# EAGLE design core (EAGLE 7.1.0)
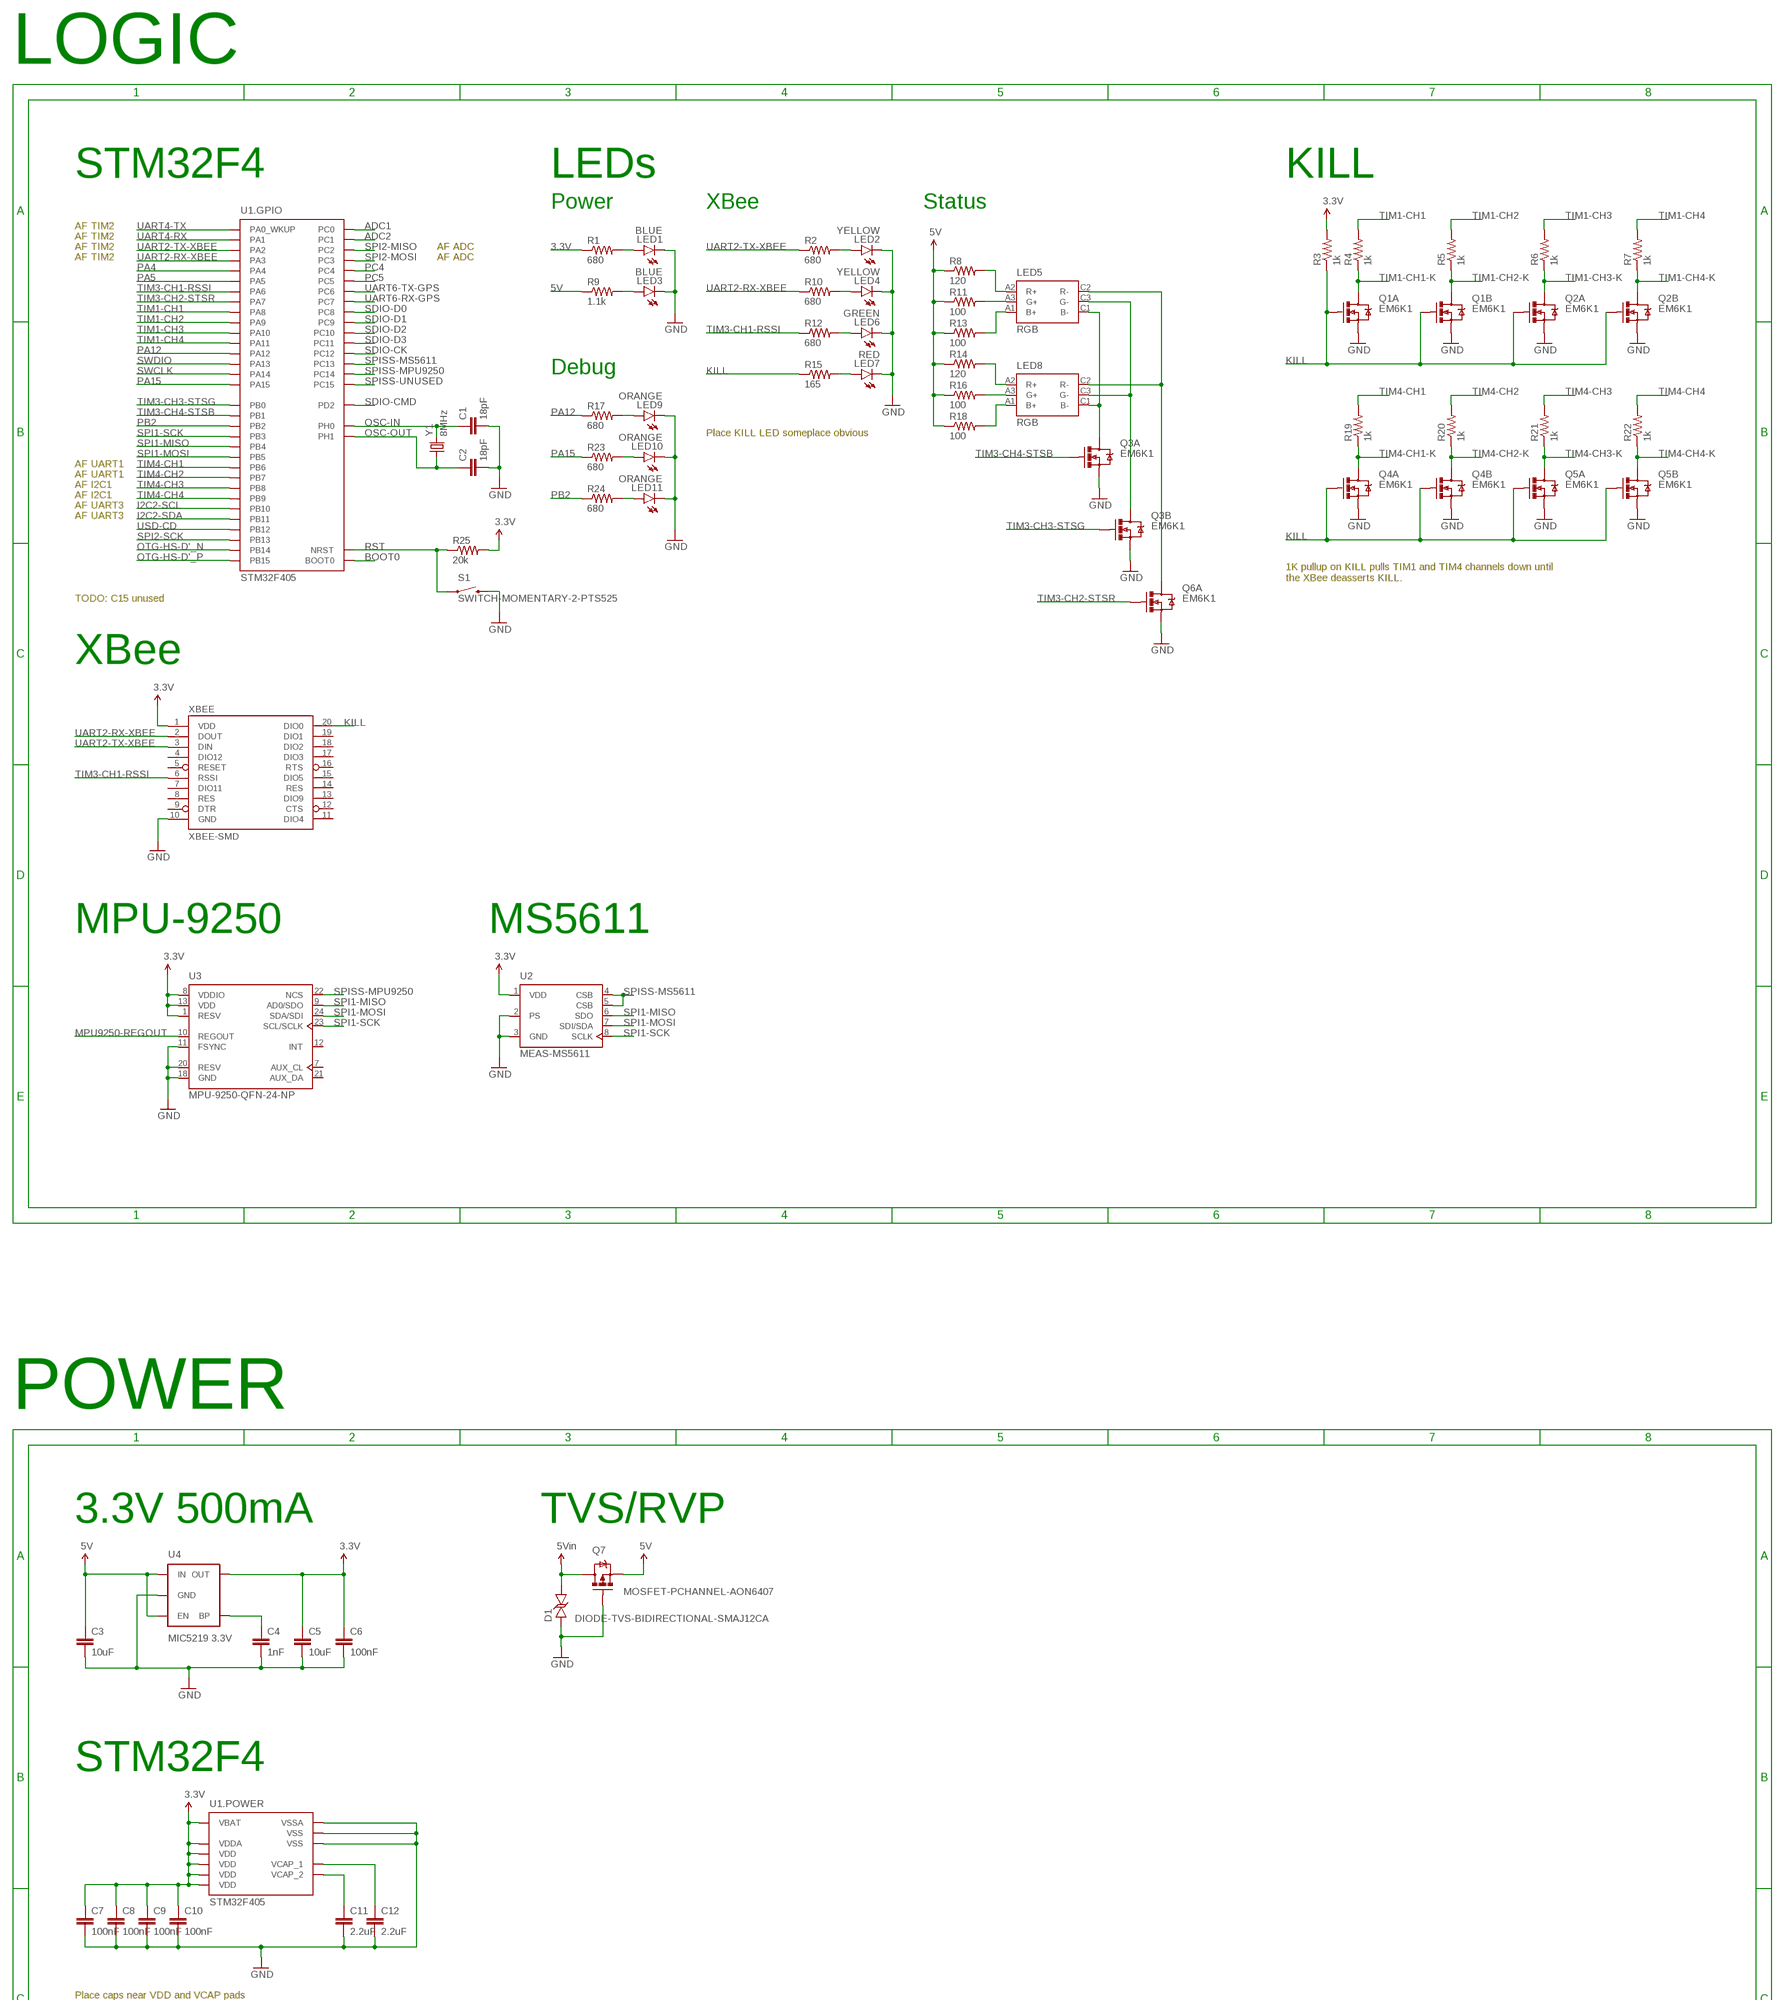
[diagram p0: schematic, sheet 1, part 1 of 2]
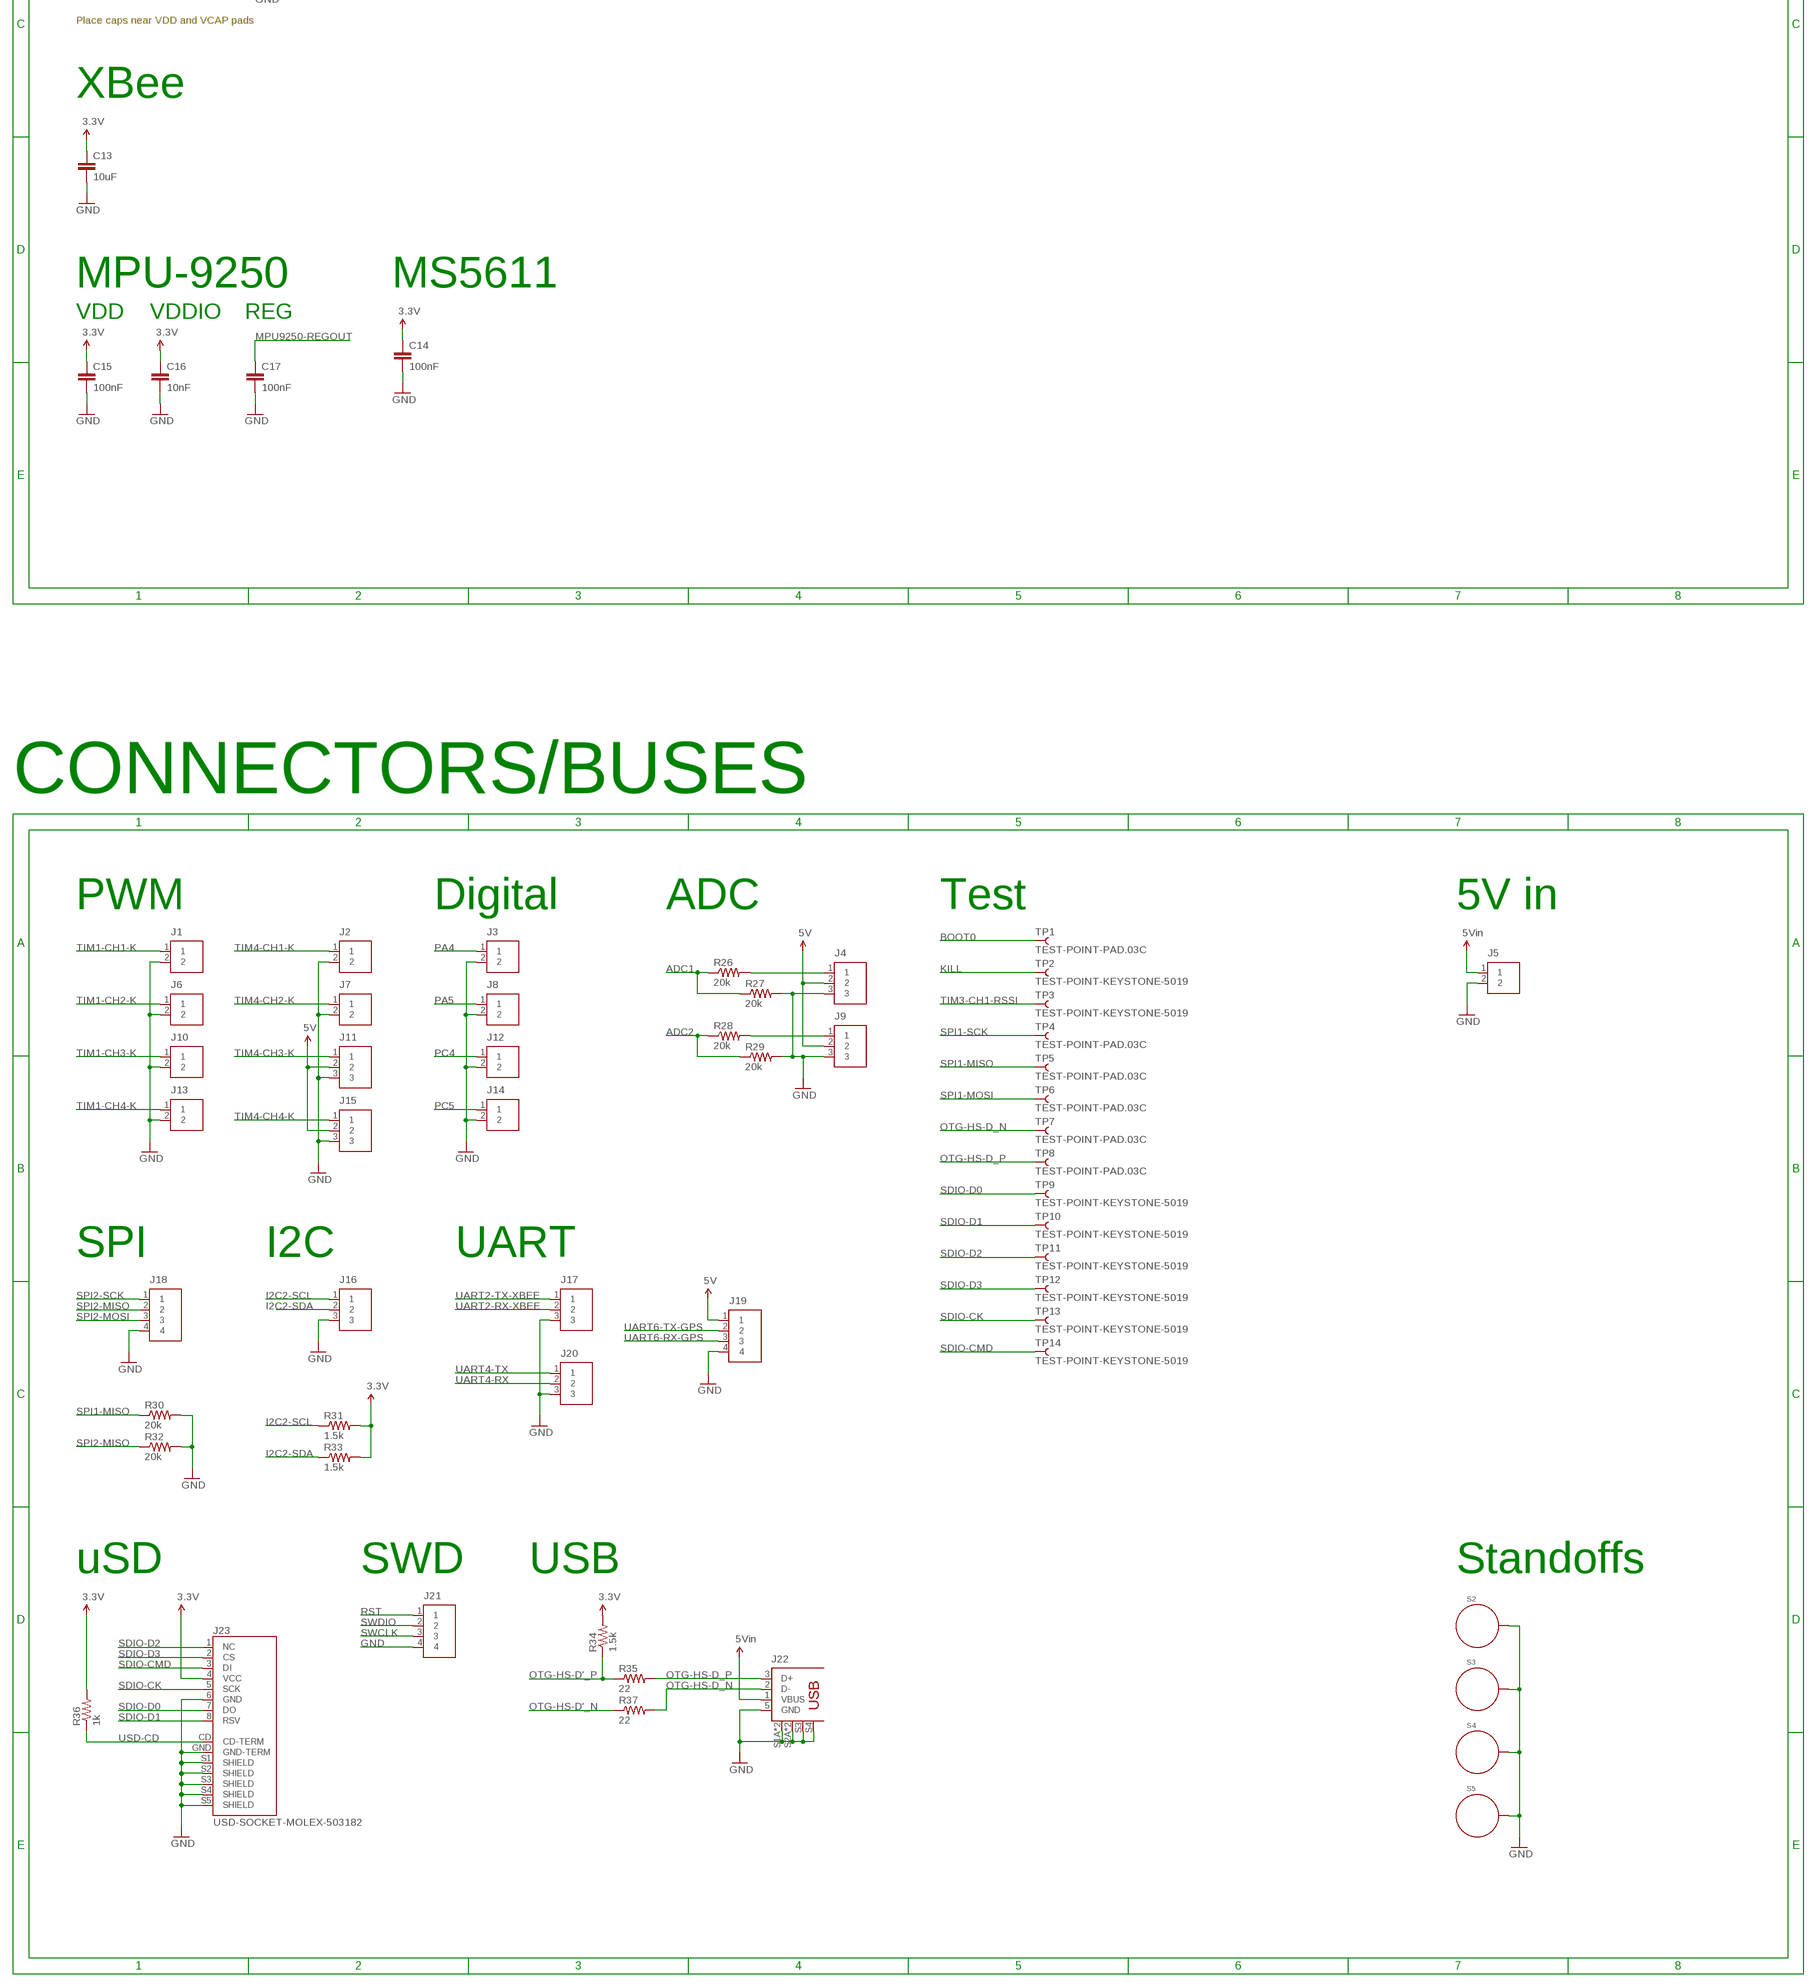
[diagram p1: schematic, sheet 1, part 2 of 2]

## Parts
C1  18pF  CAP-18PF-50V-5%(0603)  [0603]
C2  18pF  CAP-18PF-50V-5%(0603)  [0603]
C3  10uF  CAP-10UF-10V-10%(0805)  [0805]
C4  1nF  CAP-1NF-50V-10%(0603)  [0603]
C5  10uF  CAP-10UF-10V-10%(0805)  [0805]
C6  100nF  CAP-100NF-16V-10%(0603)  [0603]
C7  100nF  CAP-100NF-16V-10%(0603)  [0603]
C8  100nF  CAP-100NF-16V-10%(0603)  [0603]
C9  100nF  CAP-100NF-16V-10%(0603)  [0603]
C10  100nF  CAP-100NF-16V-10%(0603)  [0603]
C11  2.2uF  CAP-2.2UF-10V-10%(0603)  [0603]
C12  2.2uF  CAP-2.2UF-10V-10%(0603)  [0603]
C13  10uF  CAP-10UF-10V-10%(0805)  [0805]
C14  100nF  CAP-100NF-16V-10%(0603)  [0603]
C15  100nF  CAP-100NF-16V-10%(0603)  [0603]
C16  10nF  CAP-10NF-50V-10%(0603)  [0603]
C17  100nF  CAP-100NF-16V-10%(0603)  [0603]
D1  DIODE-TVS-BIDIRECTIONAL-SMAJ12CA  [SMAJ]
J1  M02  [MOLEX-2MM-MICROLATCH-2POS-RA]
J2  M02  [MOLEX-2MM-MICROLATCH-2POS-RA]
J3  M02  [MOLEX-2MM-MICROLATCH-2POS-RA]
J4  M03  [MOLEX-2MM-MICROLATCH-3POS-RA]
J5  M02  [MOLEX-2MM-MICROLATCH-2POS-RA]
J6  M02  [MOLEX-2MM-MICROLATCH-2POS-RA]
J7  M02  [MOLEX-2MM-MICROLATCH-2POS-RA]
J8  M02  [MOLEX-2MM-MICROLATCH-2POS-RA]
J9  M03  [MOLEX-2MM-MICROLATCH-3POS-RA]
J10  M02  [MOLEX-2MM-MICROLATCH-2POS-RA]
J11  M03  [MOLEX-2MM-MICROLATCH-3POS-RA]
J12  M02  [MOLEX-2MM-MICROLATCH-2POS-RA]
J13  M02  [MOLEX-2MM-MICROLATCH-2POS-RA]
J14  M02  [MOLEX-2MM-MICROLATCH-2POS-RA]
J15  M03  [MOLEX-2MM-MICROLATCH-3POS-RA]
J16  M03  [MOLEX-2MM-MICROLATCH-3POS-RA]
J17  M03  [MOLEX-2MM-MICROLATCH-3POS-RA]
J18  M04  [MOLEX-2MM-MICROLATCH-4POS-RA]
J19  M04  [MOLEX-2MM-MICROLATCH-4POS-RA]
J20  M03  [MOLEX-2MM-MICROLATCH-3POS-RA]
J21  M04  [MOLEX-2MM-MICROLATCH-4POS-RA]
J22  USB+SHIELD-MICROB-SMD-MOLEX  [USB-MICROB-SMD-MOLEX]
J23  USD-SOCKET-MOLEX-503182  [USD-SOCKET-PP-MOLEX-503182]
LED1  BLUE  LED-KINGBRIGHT-HELI-BLUE(0603)  [LED-0603]
LED2  YELLOW  LED-KINGBRIGHT-HELI-YELLOW(0603)  [LED-0603]
LED3  BLUE  LED-KINGBRIGHT-HELI-BLUE(0603)  [LED-0603]
LED4  YELLOW  LED-KINGBRIGHT-HELI-YELLOW(0603)  [LED-0603]
LED5  RGB  OSRAM-MULTILED-RGB  [PLCC-6]
LED6  GREEN  LED-KINGBRIGHT-HELI-GREEN(0603)  [LED-0603]
LED7  RED  LED-KINGBRIGHT-HELI-RED(0603)  [LED-0603]
LED8  RGB  OSRAM-MULTILED-RGB  [PLCC-6]
LED9  ORANGE  LED-KINGBRIGHT-HELI-ORANGE(0603)  [LED-0603]
LED10  ORANGE  LED-KINGBRIGHT-HELI-ORANGE(0603)  [LED-0603]
LED11  ORANGE  LED-KINGBRIGHT-HELI-ORANGE(0603)  [LED-0603]
Q1  EM6K1  MOSFET-NCHANNEL-DUAL-EM6K1  [SOT-666]
Q2  EM6K1  MOSFET-NCHANNEL-DUAL-EM6K1  [SOT-666]
Q3  EM6K1  MOSFET-NCHANNEL-DUAL-EM6K1  [SOT-666]
Q4  EM6K1  MOSFET-NCHANNEL-DUAL-EM6K1  [SOT-666]
Q5  EM6K1  MOSFET-NCHANNEL-DUAL-EM6K1  [SOT-666]
Q6  EM6K1  MOSFET-NCHANNEL-DUAL-EM6K1  [SOT-666]
Q7  MOSFET-PCHANNEL-AON6407  [DFN5X6]
R1  680  RES-680OHM-0.1W-5%(0603)  [0603]
R2  680  RES-680OHM-0.1W-5%(0603)  [0603]
R3  1k  RES-1KOHM-0.1W-5%(0603)  [0603]
R4  1k  RES-1KOHM-0.1W-5%(0603)  [0603]
R5  1k  RES-1KOHM-0.1W-5%(0603)  [0603]
R6  1k  RES-1KOHM-0.1W-5%(0603)  [0603]
R7  1k  RES-1KOHM-0.1W-5%(0603)  [0603]
R8  120  RES-120OHM-0.1W-5%(0603)  [0603]
R9  1.1k  RES-1.1KOHM-0.1W-5%(0603)  [0603]
R10  680  RES-680OHM-0.1W-5%(0603)  [0603]
R11  100  RES-100OHM-0.1W-5%(0603)  [0603]
R12  680  RES-680OHM-0.1W-5%(0603)  [0603]
R13  100  RES-100OHM-0.1W-5%(0603)  [0603]
R14  120  RES-120OHM-0.1W-5%(0603)  [0603]
R15  165  RES-165OHM-0.1W-1%(0603)  [0603]
R16  100  RES-100OHM-0.1W-5%(0603)  [0603]
R17  680  RES-680OHM-0.1W-5%(0603)  [0603]
R18  100  RES-100OHM-0.1W-5%(0603)  [0603]
R19  1k  RES-1KOHM-0.1W-5%(0603)  [0603]
R20  1k  RES-1KOHM-0.1W-5%(0603)  [0603]
R21  1k  RES-1KOHM-0.1W-5%(0603)  [0603]
R22  1k  RES-1KOHM-0.1W-5%(0603)  [0603]
R23  680  RES-680OHM-0.1W-5%(0603)  [0603]
R24  680  RES-680OHM-0.1W-5%(0603)  [0603]
R25  20k  RES-20KOHM-0.1W-1%(0603)  [0603]
R26  20k  RES-20KOHM-0.1W-0.1%(0603)  [0603]
R27  20k  RES-20KOHM-0.1W-0.1%(0603)  [0603]
R28  20k  RES-20KOHM-0.1W-0.1%(0603)  [0603]
R29  20k  RES-20KOHM-0.1W-0.1%(0603)  [0603]
R30  20k  RES-20KOHM-0.1W-1%(0603)  [0603]
R31  1.5k  RES-1.5KOHM-0.1W-5%(0603)  [0603]
R32  20k  RES-20KOHM-0.1W-1%(0603)  [0603]
R33  1.5k  RES-1.5KOHM-0.1W-5%(0603)  [0603]
R34  1.5k  RES-1.5KOHM-0.1W-5%(0603)  [0603]
R35  22  RES-22OHM-0.1W-5%(0603)  [0603]
R36  1k  RES-1KOHM-0.1W-5%(0603)  [0603]
R37  22  RES-22OHM-0.1W-5%(0603)  [0603]
S1  SWITCH-MOMENTARY-2-PTS525  [TACTILE-SWITCH-SMD]
S2  STANDOFF_ELECTRICAL-#4  [STANDOFF-ELECTRICAL-#4]
S3  STANDOFF_ELECTRICAL-#4  [STANDOFF-ELECTRICAL-#4]
S4  STANDOFF_ELECTRICAL-#4  [STANDOFF-ELECTRICAL-#4]
S5  STANDOFF_ELECTRICAL-#4  [STANDOFF-ELECTRICAL-#4]
TP1  TEST-POINT-PAD.03C  [PAD-.03C]
TP2  TEST-POINT-KEYSTONE-5019  [PAD.15X.08]
TP3  TEST-POINT-KEYSTONE-5019  [PAD.15X.08]
TP4  TEST-POINT-PAD.03C  [PAD-.03C]
TP5  TEST-POINT-PAD.03C  [PAD-.03C]
TP6  TEST-POINT-PAD.03C  [PAD-.03C]
TP7  TEST-POINT-PAD.03C  [PAD-.03C]
TP8  TEST-POINT-PAD.03C  [PAD-.03C]
TP9  TEST-POINT-KEYSTONE-5019  [PAD.15X.08]
TP10  TEST-POINT-KEYSTONE-5019  [PAD.15X.08]
TP11  TEST-POINT-KEYSTONE-5019  [PAD.15X.08]
TP12  TEST-POINT-KEYSTONE-5019  [PAD.15X.08]
TP13  TEST-POINT-KEYSTONE-5019  [PAD.15X.08]
TP14  TEST-POINT-KEYSTONE-5019  [PAD.15X.08]
U1  STM32F405  [LQFP-64-STM32F405]
U2  MEAS-MS5611  [MEAS-MS5611]
U3  MPU-9250-QFN-24-NP  [QFN-24-NP]
U4  MIC5219 3.3V  V-REG-MIC5219-3.3V  [SOT23-5]
XBEE  XBEE-SMD  [XBEE-SMD]
Y1  8MHz  CRYSTAL-8MHZ-CX532  [CX532]

## Nets
3.3V: C5.2 C6.2 C7.2 C8.2 C9.2 C10.2 C13.2 C14.2 C15.2 C16.2 J23.4(VCC) R1.1 R3.2 R25.2 R31.2 R33.2 R34.2 R36.2 U1.1(.POWER:VBAT) U1.13(.POWER:VDDA) U1.19(.POWER:VDD) U1.32(.POWER:VDD) U1.48(.POWER:VDD) U1.64(.POWER:VDD) U2.1(VDD) U3.1(RESV) U3.8(VDDIO) U3.13(VDD) U4.5(OUT) XBEE.1(VDD)
5V: C3.2 J4.2 J9.2 J11.2 J15.2 J19.1 Q7.1(S) Q7.2(S) Q7.3(S) R8.1 R9.1 R11.1 R13.1 R14.1 R16.1 R18.1 U4.1(IN) U4.3(EN)
ADC1: R26.1 R27.1 U1.8(.GPIO:PC0)
ADC1-IN: J4.1 R26.2
ADC2: R28.1 R29.1 U1.9(.GPIO:PC1)
ADC2-IN: J9.1 R28.2
BOOT0: TP1.1 U1.60(.GPIO:BOOT0)
F4-VCAP-1: C11.2 U1.47(.POWER:VCAP_2)
F4-VCAP-2: C12.2 U1.31(.POWER:VCAP_1)
GND: C1.1 C2.1 C3.1 C4.1 C5.1 C6.1 C7.1 C8.1 C9.1 C10.1 C11.1 C12.1 C13.1 C14.1 C15.1 C16.1 C17.1 D1.A J1.2 J2.2 J3.2 J4.3 J5.2 J6.2 J7.2 J8.2 J9.3 J10.2 J11.3 J12.2 J13.2 J14.2 J15.3 J16.3 J17.3 J18.4 J19.4 J20.3 J21.4 J22.5(GND) J22.S1A(S1) J22.S1B(S1) J22.S2A(S2) J22.S2B(S2) J22.S3 J22.S4 J23.6(GND) J23.GND(GND-TERM) J23.S1(SHIELD) J23.S2(SHIELD) J23.S3(SHIELD) J23.S4(SHIELD) J23.S5(SHIELD) LED1.C LED2.C LED3.C LED4.C LED6.C LED7.C LED9.C LED10.C LED11.C Q1.1(A:S) Q1.4(B:S) Q2.1(A:S) Q2.4(B:S) Q3.1(A:S) Q3.4(B:S) Q4.1(A:S) Q4.4(B:S) Q5.1(A:S) Q5.4(B:S) Q6.1(A:S) Q7.4(G) R27.2 R29.2 R30.2 R32.2 S1.3 S1.4 S2.P1 S3.P1 S4.P1 S5.P1 U1.12(.POWER:VSSA) U1.18(.POWER:VSS) U1.63(.POWER:VSS) U2.2(PS) U2.3(GND) U3.11(FSYNC) U3.18(GND) U3.20(RESV) U4.2(GND) XBEE.10(GND)
I2C2-SCL: J16.1 R31.1 U1.29(.GPIO:PB10)
I2C2-SDA: J16.2 R33.1 U1.30(.GPIO:PB11)
KILL: Q1.2(A:G) Q1.5(B:G) Q2.2(A:G) Q2.5(B:G) Q4.2(A:G) Q4.5(B:G) Q5.2(A:G) Q5.5(B:G) R3.1 R15.1 TP2.1 XBEE.20(DIO0)
MIC-BP: C4.2 U4.4(BP)
MPU9250-REGOUT: C17.2 U3.10(REGOUT)
N$2: LED9.A R17.2
N$3: LED10.A R23.2
N$4: LED11.A R24.2
N$34: LED6.A R12.2
N$35: LED7.A R15.2
N$36: LED2.A R2.2
N$37: LED4.A R10.2
N$38: LED1.A R1.2
N$39: LED3.A R9.2
OSC-IN: C1.2 U1.5(.GPIO:PH0) Y1.2
OSC-OUT: C2.2 U1.6(.GPIO:PH1) Y1.1
OTG-HS-D'_N [USB]: R37.1 U1.35(.GPIO:PB14)
OTG-HS-D'_P [USB]: R34.1 R35.1 U1.36(.GPIO:PB15)
OTG-HS-D_N [USB]: J22.2(D-) R37.2 TP7.1
OTG-HS-D_P [USB]: J22.3(D+) R35.2 TP8.1
PA4: J3.1 U1.20(.GPIO:PA4)
PA5: J8.1 U1.21(.GPIO:PA5)
PA12: R17.1 U1.45(.GPIO:PA12)
PA15: R23.1 U1.50(.GPIO:PA15)
PB2: R24.1 U1.28(.GPIO:PB2)
PC4: J12.1 U1.24(.GPIO:PC4)
PC5: J14.1 U1.25(.GPIO:PC5)
RST: J21.1 R25.1 S1.1 S1.2 U1.7(.GPIO:NRST)
SDIO-CK: J23.5(SCK) TP13.1 U1.53(.GPIO:PC12)
SDIO-CMD: J23.3(DI) TP14.1 U1.54(.GPIO:PD2)
SDIO-D0: J23.7(DO) TP9.1 U1.39(.GPIO:PC8)
SDIO-D1: J23.8(RSV) TP10.1 U1.40(.GPIO:PC9)
SDIO-D2: J23.1(NC) TP11.1 U1.51(.GPIO:PC10)
SDIO-D3: J23.2(CS) TP12.1 U1.52(.GPIO:PC11)
SPI1-MISO: R30.1 TP5.1 U1.56(.GPIO:PB4) U2.6(SDO) U3.9(AD0/SDO)
SPI1-MOSI: TP6.1 U1.57(.GPIO:PB5) U2.7(SDI/SDA) U3.24(SDA/SDI)
SPI1-SCK: TP4.1 U1.55(.GPIO:PB3) U2.8(SCLK) U3.23(SCL/SCLK)
SPI2-MISO: J18.2 R32.1 U1.10(.GPIO:PC2)
SPI2-MOSI: J18.3 U1.11(.GPIO:PC3)
SPI2-SCK: J18.1 U1.34(.GPIO:PB13)
SPISS-MPU9250: U1.3(.GPIO:PC14) U3.22(NCS)
SPISS-MS5611: U1.2(.GPIO:PC13) U2.4(CSB) U2.5(CSB)
SPISS-UNUSED: U1.4(.GPIO:PC15)
STSB1+: LED5.A1(B+) R13.2
STSB2+: LED8.A1(B+) R18.2
STSB-: LED5.C1(B-) LED8.C1(B-) Q3.6(A:D)
STSG1+: LED5.A3(G+) R11.2
STSG2+: LED8.A3(G+) R16.2
STSG-: LED5.C3(G-) LED8.C3(G-) Q3.3(B:D)
STSR1+: LED5.A2(R+) R8.2
STSR2+: LED8.A2(R+) R14.2
STSR-: LED5.C2(R-) LED8.C2(R-) Q6.6(A:D)
SWCLK: J21.3 U1.49(.GPIO:PA14)
SWDIO: J21.2 U1.46(.GPIO:PA13)
TIM1-CH1: R4.2 U1.41(.GPIO:PA8)
TIM1-CH1-K: J1.1 Q1.6(A:D) R4.1
TIM1-CH2: R5.2 U1.42(.GPIO:PA9)
TIM1-CH2-K: J6.1 Q1.3(B:D) R5.1
TIM1-CH3: R6.2 U1.43(.GPIO:PA10)
TIM1-CH3-K: J10.1 Q2.6(A:D) R6.1
TIM1-CH4: R7.2 U1.44(.GPIO:PA11)
TIM1-CH4-K: J13.1 Q2.3(B:D) R7.1
TIM3-CH1-RSSI: R12.1 TP3.1 U1.22(.GPIO:PA6) XBEE.6(RSSI)
TIM3-CH2-STSR: Q6.2(A:G) U1.23(.GPIO:PA7)
TIM3-CH3-STSG: Q3.5(B:G) U1.26(.GPIO:PB0)
TIM3-CH4-STSB: Q3.2(A:G) U1.27(.GPIO:PB1)
TIM4-CH1: R19.2 U1.58(.GPIO:PB6)
TIM4-CH1-K: J2.1 Q4.6(A:D) R19.1
TIM4-CH2: R20.2 U1.59(.GPIO:PB7)
TIM4-CH2-K: J7.1 Q4.3(B:D) R20.1
TIM4-CH3: R21.2 U1.61(.GPIO:PB8)
TIM4-CH3-K: J11.1 Q5.6(A:D) R21.1
TIM4-CH4: R22.2 U1.62(.GPIO:PB9)
TIM4-CH4-K: J15.1 Q5.3(B:D) R22.1
UART2-RX-XBEE: J17.2 R10.1 U1.17(.GPIO:PA3) XBEE.2(DOUT)
UART2-TX-XBEE: J17.1 R2.1 U1.16(.GPIO:PA2) XBEE.3(DIN)
UART4-RX: J20.2 U1.15(.GPIO:PA1)
UART4-TX: J20.1 U1.14(.GPIO:PA0_WKUP)
UART6-RX-GPS: J19.3 U1.38(.GPIO:PC7)
UART6-TX-GPS: J19.2 U1.37(.GPIO:PC6)
USD-CD: J23.CD(CD-TERM) R36.1 U1.33(.GPIO:PB12)
VIN: D1.C J5.1 J22.1(VBUS) Q7.5(D) Q7.6(D) Q7.7(D) Q7.8(D) Q7.9(D) Q7.10(D) ; supply symbol labelled 5Vin
Unconnected: Q6.3(B:D) Q6.4(B:S) Q6.5(B:G) U3.7(AUX_CL) U3.12(INT) U3.21(AUX_DA) XBEE.4(DIO12) XBEE.5(RESET) XBEE.7(DIO11) XBEE.8(RES) XBEE.9(DTR) XBEE.11(DIO4) XBEE.12(CTS) XBEE.13(DIO9) XBEE.14(RES) XBEE.15(DIO5) XBEE.16(RTS) XBEE.17(DIO3) XBEE.18(DIO2) XBEE.19(DIO1)

## Notes on the sheet
- LOGIC
- STM32F4 | LEDs | KILL
- Power | XBee | Status
- AF TIM2
- AF TIM2
- AF TIM2 | AF ADC
- AF TIM2 | AF ADC
- Debug
- Place KILL LED someplace obvious
- AF UART1
- AF UART1
- AF I2C1
- AF I2C1
- AF UART3
- AF UART3
- 1K pullup on KILL pulls TIM1 and TIM4 channels down until 
  the XBee deasserts KILL.
- TODO: C15 unused
- XBee
- MPU-9250 | MS5611
- POWER
- 3.3V 500mA | TVS/RVP
- STM32F4
- Place caps near VDD and VCAP pads
- XBee
- MPU-9250 | MS5611
- VDD | VDDIO | REG
- CONNECTORS/BUSES
- PWM | Digital | ADC | Test | 5V in
- SPI | I2C | UART
- uSD | SWD | USB | Standoffs

## Library data of the parts
C1 C2 = OSURC_Passives:CAP; DIGIKEY_PN: 490-1409-1-ND
C3 C5 C13 = OSURC_Passives:CAP; DIGIKEY_PN: 490-1709-1-ND
C4 = OSURC_Passives:CAP; DIGIKEY_PN: 490-1494-1-ND
C6-C10 C14 C15 C17 = OSURC_Passives:CAP; DIGIKEY_PN: 490-1532-1-ND
C11 C12 = OSURC_Passives:CAP; DIGIKEY_PN: 490-1545-1-ND
C16 = OSURC_Passives:CAP; DIGIKEY_PN: 490-1512-1-ND
D1 = OSURC_DiscreteSemi:DIODE-TVS-BIDIRECTIONAL: Generic bidirectional TVS diode.; DIGIKEY_PN: SMAJ12CABCT-ND
J1-J3 J5-J8 J10 J12-J14 = OSURC_Connectors:M02; DIGIKEY_PN: WM18999-ND
J4 J9 J11 J15-J17 J20 = OSURC_Connectors:M03; DIGIKEY_PN: WM19000-ND
J18 J19 J21 = OSURC_Connectors:M04; DIGIKEY_PN: WM19001-ND
J22 = OSURC_Connectors:USB+SHIELD: USB+Shield USB connector with shield pins connectable; DIGIKEY_PN: WM17141CT-ND
J23 = OSURC_Connectors:USD-SOCKET: Molex microSD socket Push-push type uSD socket. tDoc lines correctly indicate media card edge positions when inserting (unlocked, locked, depressed).; DIGIKEY_PN: WM9750CT-ND
LED1 LED3 = OSURC_LED:LED-KINGBRIGHT-HELI: Kingbright HELI series LEDs. 0603 package, hella bright.; DIGIKEY_PN: 754-1789-1-ND
LED2 LED4 = OSURC_LED:LED-KINGBRIGHT-HELI: Kingbright HELI series LEDs. 0603 package, hella bright.; DIGIKEY_PN: 754-1788-1-ND
LED5 LED8 = OSURC_LED:OSRAM-MULTILED-RGB: Compact, blindingly bright RGB LED.; DIGIKEY_PN: 475-2899-1-ND
LED6 = OSURC_LED:LED-KINGBRIGHT-HELI: Kingbright HELI series LEDs. 0603 package, hella bright.; DIGIKEY_PN: 754-1790-1-ND
LED7 = OSURC_LED:LED-KINGBRIGHT-HELI: Kingbright HELI series LEDs. 0603 package, hella bright.; DIGIKEY_PN: 754-1786-1-ND
LED9-LED11 = OSURC_LED:LED-KINGBRIGHT-HELI: Kingbright HELI series LEDs. 0603 package, hella bright.; DIGIKEY_PN: 754-1787-1-ND
Q1-Q6 = OSURC_DiscreteSemi:MOSFET-NCHANNEL-DUAL: Dual N-Channel 30-V (D-S) MOSFET FDMA1024NZ TRANS-09516 http://www.vishay.com/docs/71053/71053.pdf; DIGIKEY_PN: EM6K1T2RCT-ND
Q7 = OSURC_DiscreteSemi:MOSFET-PCHANNEL: Generic PMOSFET IRLML2244 - TRANS-11153 (SOT-23 -20V -4.3A) (1.Gate 2.Source 3.Drain) FQP27P06 - COM-10349 <http://www.sparkfun.com/products/10349> (TO-220 -60V -27A) (1.Gate 2.Source 3.Drain); DIGIKEY_PN: 785-1421-1-ND
R1 R2 R10 R12 R17 R23 R24 = OSURC_Passives:RES; DIGIKEY_PN: P680GCT-ND
R3-R7 R19-R22 R36 = OSURC_Passives:RES; DIGIKEY_PN: P1.0KGCT-ND
R8 R14 = OSURC_Passives:RES; DIGIKEY_PN: P120GCT-ND
R9 = OSURC_Passives:RES; DIGIKEY_PN: P1.1KGCT-ND
R11 R13 R16 R18 = OSURC_Passives:RES; DIGIKEY_PN: P100GCT-ND
R15 = OSURC_Passives:RES; DIGIKEY_PN: P165HCT-ND
R25 R30 R32 = OSURC_Passives:RES; DIGIKEY_PN: P20.0KHCT-ND
R26-R29 = OSURC_Passives:RES; DIGIKEY_PN: P20KDBCT-ND
R31 R33 R34 = OSURC_Passives:RES; DIGIKEY_PN: P1.5KGCT-ND
R35 R37 = OSURC_Passives:RES; DIGIKEY_PN: P22GCT-ND
S1 = OSURC_Electromechanical:SWITCH-MOMENTARY-2: Various NO switches- pushbuttons, reed, etc; DIGIKEY_PN: CKN9104CT-ND
S2-S5 = OSURC_Electromechanical:STANDOFF_ELECTRICAL: A standoff intended to be an electrically connected point. Pad size and stop size allow for a #4 Phillips pan screw head to make a solid connection to the board.
TP1 TP4-TP8 = OSURC_Passives:TEST-POINT: Test points
TP2 TP3 TP9-TP14 = OSURC_Passives:TEST-POINT: Test points; DIGIKEY_PN: 5019KCT-ND
U1 = OSURC_DigitalIC:STM32F405: Fast little Cortex-M4 ARM used by everyone jumping on the custom flight control bandwagon.; DIGIKEY_PN: 497-11767-ND
U2 = OSURC_Sensors:MEAS-MS5611: Fast, accurate barometer.; CDI_PN: MS561101BA03-50
U3 = OSURC_Sensors:MPU-9250: 9DOF (3mag, 3accel, 3gyro). SPI/I2C interface.; CDI_PN: MPU-9250
U4 = OSURC_PowerIC:V-REG-MIC5219: V_REG MIC5219 Standard 3.3V and 5V 500mA LDO voltage regulator in SOT-23 layout. Micrel part MIC5219. BP (by-pass) pin is used to lower output noise with 470pF cap, may be left open.; DIGIKEY_PN: 576-1281-1-ND
XBEE = OSURC_RF:XBEE: Xbee module footprints; DIGIKEY_PN: S5902-10-ND
Y1 = OSURC_FreqCtrl:CRYSTAL: Various standard crystals. Proven footprints.; DIGIKEY_PN: 370-1169-1-ND

## Net classes
1 USB: width 0.61 mm

## Board
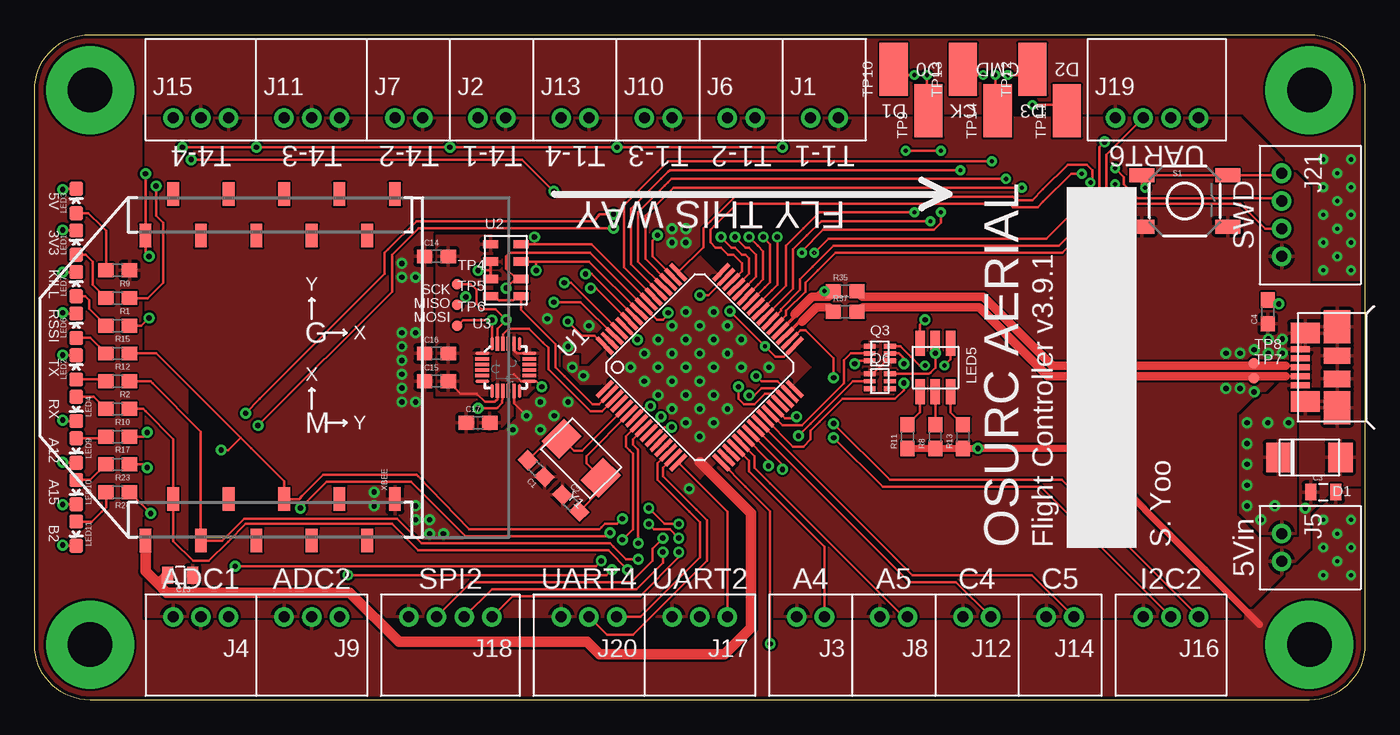
[diagram p2: board, top side]
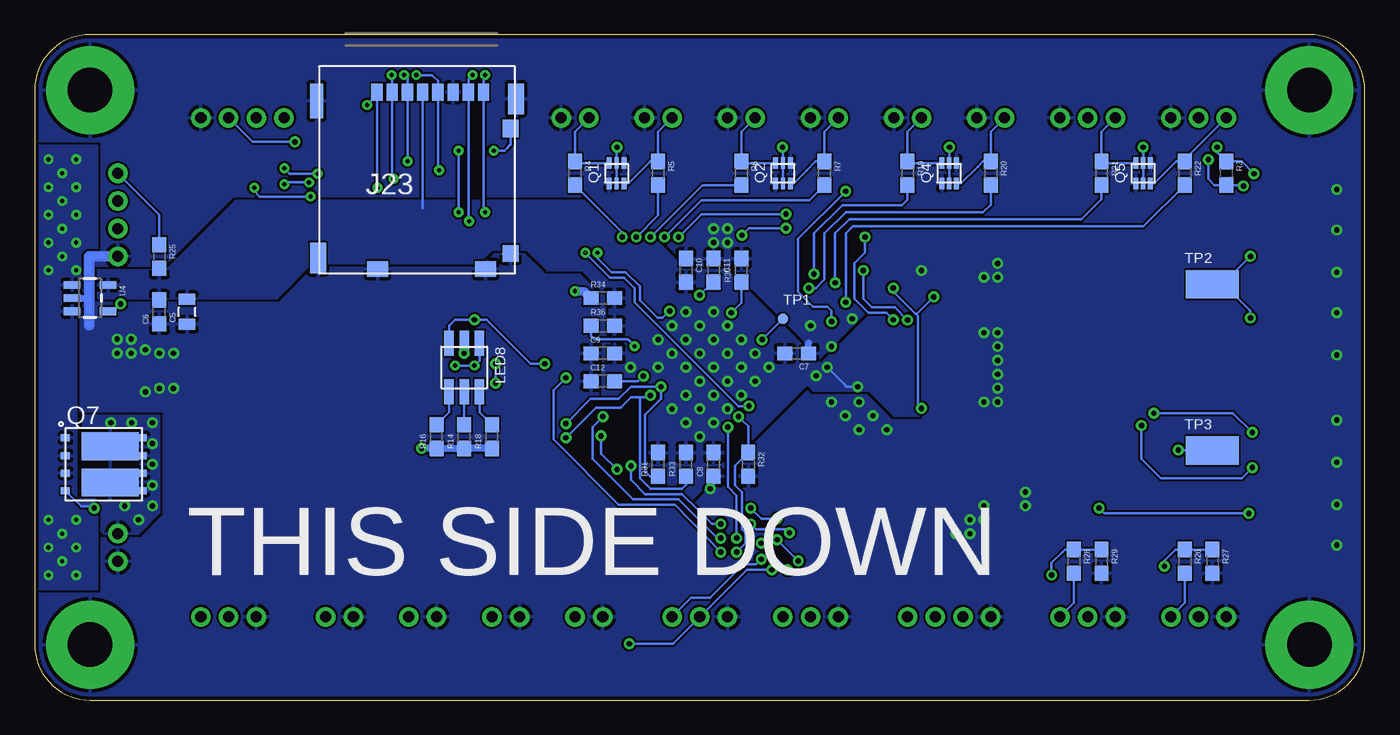
[diagram p3: board, bottom side, seen from below]

Size 96 x 48 mm. Coordinates in mm from the lower left corner, seen from the top.
Outline: 4,48 92,48 arc-90 96,44 96,4 arc-90 92,0 4,0 arc-90 0,4 0,44 arc-90 4,48
Copper layers (1*16): Top 0.035mm / dielectric 1.5mm / Bottom 0.035mm
Design rules "core": minimum track width 6mil, minimum drill 12mil, track to track 6mil, track to pad 6mil, pad to pad 6mil, via to via 6mil, smd to smd 0mil, copper to edge 10mil, drill to drill 10mil, minimum pad ring 12mil, minimum via ring 8mil, stop-mask expansion 2mil, vias tented up to drill 25mil, thermal gap 10mil

### Footprints (pad centres in the part's own frame; a part is rotated, then mirrored left to right if it is on the bottom)
0603 = smd 1.1 x 1: 1 -0.85,0; 2 0.85,0
0805 = smd 0.8 x 1.2: 1 -0.9,0; 2 0.9,0
SMAJ = smd 1.778 x 2.108: A -2.235,0; C 2.235,0
MOLEX-2MM-MICROLATCH-2POS-RA = drill 0.8: 1 0,0; 2 2,0
MOLEX-2MM-MICROLATCH-3POS-RA = drill 0.8: 1 0,0; 2 2,0; 3 4,0
MOLEX-2MM-MICROLATCH-4POS-RA = drill 0.8: 1 0,0; 2 2,0; 3 4,0; 4 6,0
USB-MICROB-SMD-MOLEX = smd 0.45 x 1.38: 1 -1.3,2.66; 2 -0.65,2.66; 3 0,2.66; 4 0.65,2.66; 5 1.3,2.66 | smd 2.375 x 1.9: S1A -2.913,0; S2A 2.913,0 | smd 1.175 x 1.9: S1B -0.838,0; S2B 0.838,0 | smd 1.475 x 2.1: S3 -2.462,2.3; S4 2.462,2.3
USD-SOCKET-PP-MOLEX-503182 = smd 0.8 x 1.24: 1 4.82,-0.62; 2 5.92,-0.62; 3 7.02,-0.62; 4 8.12,-0.62; 5 9.22,-0.62; 6 10.32,-0.62; 7 11.42,-0.62; 8 12.52,-0.62 | smd 1.16 x 1.25: CD 14.46,-3.25 | smd 1.16 x 1.2: GND 14.46,-12.25 | smd 1.15 x 2.2: S1 14.865,-1.1; S3 0.575,-12.58 | smd 0.95 x 2.5: S2 0.475,-1.25 | smd 1.5 x 1.15: S4 4.88,-13.375; S5 12.66,-13.375
LED-0603 = smd 1 x 1: A 0,-0.877; C 0,0.877
PLCC-6 = smd 1.8 x 0.7: A1 1.75,1.1; A2 1.75,0; A3 1.75,-1.1; C1 -1.75,1.1; C2 -1.75,0; C3 -1.75,-1.1
SOT-666 = smd 0.84 x 0.36: 1 -0.73,0.53; 3 -0.73,-0.53; 4 0.73,-0.53; 6 0.73,0.53 | smd 0.84 x 0.3: 2 -0.73,0; 5 0.73,0
DFN5X6 = smd 0.65 x 0.5: 1 -2.775,1.905; 2 -2.775,0.635; 3 -2.775,-0.635; 4 -2.775,-1.905; 5 2.775,-1.905; 6 2.775,-0.635; 7 2.775,0.635; 8 2.775,1.905 | smd 4.12 x 2: 9 0.46,1.3; 10 0.46,-1.3
TACTILE-SWITCH-SMD = smd 1.8 x 1: 1 -3.1,1.85; 2 3.1,1.85; 3 -3.1,-1.85; 4 3.1,-1.85
STANDOFF-ELECTRICAL-#4 = drill 3.2 pad 6.35: P1 0,0
PAD-.03C = smd 0.762 x 0.762: 1 0,0
PAD.15X.08 = smd 3.81 x 2.032: 1 0,0
LQFP-64-STM32F405 = smd 1.6 x 0.3: 1 -5.95,3.75; 2 -5.95,3.25; 3 -5.95,2.75; 4 -5.95,2.25; 5 -5.95,1.75; 6 -5.95,1.25; 7 -5.95,0.75; 8 -5.95,0.25; 9 -5.95,-0.25; 10 -5.95,-0.75; 11 -5.95,-1.25; 12 -5.95,-1.75; 13 -5.95,-2.25; 14 -5.95,-2.75; 15 -5.95,-3.25; 16 -5.95,-3.75; 33 5.95,-3.75; 34 5.95,-3.25; 35 5.95,-2.75; 36 5.95,-2.25; 37 5.95,-1.75; 38 5.95,-1.25; 39 5.95,-0.75; 40 5.95,-0.25; 41 5.95,0.25; 42 5.95,0.75; 43 5.95,1.25; 44 5.95,1.75; 45 5.95,2.25; 46 5.95,2.75; 47 5.95,3.25; 48 5.95,3.75 | smd 0.3 x 1.6: 17 -3.75,-5.95; 18 -3.25,-5.95; 19 -2.75,-5.95; 20 -2.25,-5.95; 21 -1.75,-5.95; 22 -1.25,-5.95; 23 -0.75,-5.95; 24 -0.25,-5.95; 25 0.25,-5.95; 26 0.75,-5.95; 27 1.25,-5.95; 28 1.75,-5.95; 29 2.25,-5.95; 30 2.75,-5.95; 31 3.25,-5.95; 32 3.75,-5.95; 49 3.75,5.95; 50 3.25,5.95; 51 2.75,5.95; 52 2.25,5.95; 53 1.75,5.95; 54 1.25,5.95; 55 0.75,5.95; 56 0.25,5.95; 57 -0.25,5.95; 58 -0.75,5.95; 59 -1.25,5.95; 60 -1.75,5.95; 61 -2.25,5.95; 62 -2.75,5.95; 63 -3.25,5.95; 64 -3.75,5.95
MEAS-MS5611 = smd 1.1 x 0.6: 1 -1.1,1.875; 2 -1.1,0.625; 3 -1.1,-0.625; 4 -1.1,-1.875; 5 1.1,-1.875; 6 1.1,-0.625; 7 1.1,0.625; 8 1.1,1.875
QFN-24-NP-3X3MM = smd 1 x 0.25: 1 -1.7,1; 2 -1.7,0.6; 3 -1.7,0.2; 4 -1.7,-0.2; 5 -1.7,-0.6; 6 -1.7,-1; 13 1.7,-1; 14 1.7,-0.6; 15 1.7,-0.2; 16 1.7,0.2; 17 1.7,0.6; 18 1.7,1 | smd 0.25 x 1: 7 -1,-1.7; 8 -0.6,-1.7; 9 -0.2,-1.7; 10 0.2,-1.7; 11 0.6,-1.7; 12 1,-1.7; 19 1,1.7; 20 0.6,1.7; 21 0.2,1.7; 22 -0.2,1.7; 23 -0.6,1.7; 24 -1,1.7
SOT23-5 = smd 0.55 x 1.2: 1 -0.95,-1.3; 2 0,-1.3; 3 0.95,-1.3; 4 0.95,1.3; 5 -0.95,1.3
XBEE-SMD = smd 1.7 x 0.85: 1 -12.5,20; 2 -9.5,18; 3 -12.5,16; 4 -9.5,14; 5 -12.5,12; 6 -9.5,10; 7 -12.5,8; 8 -9.5,6; 9 -12.5,4; 10 -9.5,2; 11 12.5,2; 12 9.5,4; 13 12.5,6; 14 9.5,8; 15 12.5,10; 16 9.5,12; 17 12.5,14; 18 9.5,16; 19 12.5,18; 20 9.5,20
CX532 = smd 1.8 x 2.3: 1 -2,0; 2 2,0

### Placement (x,y rotation side)
C1  36.19,16.69 135 top
C2  38.69,14.19 315 top
C3  93,15 0 top
C4  89,28 90 top
C5  85,28 90 bottom
C6  87,28 90 bottom
C7  41,25 180 bottom
C8  47,17 90 bottom
C9  55,25 0 bottom
C10  49,31 270 bottom
C11  47,31 270 bottom
C12  55,23 0 bottom
C13  10.5,9 180 top
C14  29,32 0 top
C15  29,23 0 top
C16  29,25 0 top
C17  32,20 0 top
D1  92,17.5 180 top
J1  56,42 0 top
J2  32,42 0 top
J3  57,6 180 top
J4  14,6 180 top
J5  90,12 270 top
J6  50,42 0 top
J7  26,42 0 top
J8  63,6 180 top
J9  22,6 180 top
J10  44,42 0 top
J11  18,42 0 top
J12  69,6 180 top
J13  38,42 0 top
J14  75,6 180 top
J15  10,42 0 top
J16  84,6 180 top
J17  50,6 180 top
J18  33,6 180 top
J19  78,42 0 top
J20  42,6 180 top
J21  90,38 270 top
J22  94,24 90 top
J23  76.12,44.47 0 bottom
LED1  3,33 0 top
LED2  3,24 0 top
LED3  3,36 0 top
LED4  3,21 180 top
LED5  65,24 270 top
LED6  3,27 0 top
LED7  3,30 0 top
LED8  65,24 270 bottom
LED9  3,18 180 top
LED10  3,15 180 top
LED11  3,12 180 top
Q1  54,38 90 bottom
Q2  42,38 90 bottom
Q3  61,25 0 top
Q4  30,38 90 bottom
Q5  16,38 90 bottom
Q6  61,23 0 top
Q7  91,17 0 bottom
R1  6,29 180 top
R2  6,23 180 top
R3  10,38 270 bottom
R4  57,38 270 bottom
R5  51,38 270 bottom
R6  45,38 270 bottom
R7  39,38 270 bottom
R8  65,19 90 top
R9  6,31 180 top
R10  6,21 180 top
R11  63,19 90 top
R12  6,25 180 top
R13  67,19 90 top
R14  65,19 90 bottom
R15  6,27 180 top
R16  67,19 90 bottom
R17  6,19 180 top
R18  63,19 90 bottom
R19  33,38 270 bottom
R20  27,38 270 bottom
R21  19,38 270 bottom
R22  13,38 270 bottom
R23  6,17 180 top
R24  6,15 180 top
R25  87,32 270 bottom
R26  13,10 270 bottom
R27  11,10 270 bottom
R28  21,10 270 bottom
R29  19,10 270 bottom
R30  45,31 90 bottom
R31  51,17 90 bottom
R32  44.5,17 270 bottom
R33  49,17 90 bottom
R34  55,29 0 bottom
R35  58.5,29.5 0 top
R36  55,27 0 bottom
R37  58.5,28 0 top
S1  83,36 0 top
S2  4,4 0 top
S3  92,4 0 top
S4  92,44 0 top
S5  4,44 0 top
TP1  42,27.5 0 bottom
TP2  11,30 0 bottom
TP3  11,18 0 bottom
TP4  30.5,30 0 top
TP5  30.5,28.5 0 top
TP6  30.5,27 0 top
TP7  88,23.2 0 top
TP8  88,24.3 0 top
TP9  64.5,42.5 90 top
TP10  62,45.5 90 top
TP11  74.5,42.5 90 top
TP12  72,45.5 90 top
TP13  67,45.5 90 top
TP14  69.5,42.5 90 top
U1  48,24 45 top
U2  34,31 0 top
U3  MPU-9250-QFN-24-NP  [QFN-24-NP-3X3MM]  34,24 0 top
U4  92,29 270 bottom
XBEE  28,24 90 top
Y1  39.44,17.44 135 top

### Tracks (layer width: path | path; a pad name or v marks a point on that pad's centre or on a via)
3.3V  (via drill 0.38)
  Top 0.178: v11.3,38.99 35.18,38.99 v37.47,36.7 | v8.76,37.08 8.76,34.92 9.27,34.42 9.27,30.1 8.17,29 R1.1 | U1.64 40.41,26.29 39.5,26.29 v38.48,27.3 | U3.8 33.4,21.7 33.2,21.5 32.5,21.5 31.9,22.1 30.75,22.1 C15.2 | 34.6,23.5 35.1,23 U3.13 36.2,23 v36.6,22.6
  Top 0.508: C13.2 9.38,9 8.83,8.45
  Top 0.762: XBEE.1 8,9.27 8.83,8.45 9.53,7.75 22.73,7.75 26.29,4.19 39.88,4.19 40.77,3.3 49.78,3.3 51.69,5.21 51.69,13.46 48.01,17.14
  Bottom 0.178: v11.3,38.99 11.3,37.59 10.86,37.15 R3.2 8.83,37.15 v8.76,37.08 | v37.47,36.7 40.89,33.27 40.89,29.46 39.81,28.38 38.8,28.38 38.48,28.07 v38.48,27.3 | J23.4 68,35.49 | v38.8,24 37.6,22.8 37.4,22.6 v36.6,22.6
  other vias: 48,27 49,26 47,26 48,25 50,25 49,24 48,23 47,24 46,25 45,24 46,23 47,22 48,21 49,22 51,24 49,28 44,23 45,22 46,21 47,20 48,19 49,20 50,21 43,24 45,26 46,27 47,28 51,26 53,24 44,25 50,27 39.6,23.4
  pour Top: 40,24 39.2,24 39.2,24.8 38.2,24.8 38.2,24 39.4,22.8 41.2,22.8 48,16 56,24 48,32
  pour Bottom (rank 3): 54,36 49,31 46,31 39,24 49.5,13.5 55,19.5 55,24 54.5,24.5 54.5,29 56.5,31 59,31 60.5,32.5 63,32.5 64,31.5 76,31.5 78.5,29 91.5,29 91.5,31 86.5,31 81.5,36
  pour Bottom (rank 2): 35,28.5 30,28.5 30,20.5 34,20.5 35.8,22.3 39.8,22.3 40.5,23
  pour Top (rank 2): 29,22 29,33.5 33,33.5 33,26 36,23 36,22.5 35.5,22
5V  (via drill 0.3, 0.38)
  Top 0.508: R18.1 R8.1 R16.1 v68.07,18.15 69.48,18.15 75.7,18.15 84.45,9.4 88.39,5.46
  Bottom 0.508: 64.99,18.16 R8.1 | R18.1 R8.1 | R8.1 R16.1 v68.07,18.15
  other vias: 95,39 93,39 94,38 95,37 93,37 94,36 95,35 93,35 94,34 95,33 93,33 94,32 95,31 93,31 95,9 93,9 94,10 93,11 95,11 94,12 95,13 93,13
  pour Top (rank 4): 10,48 96,48 96,0 10,0
  pour Top (rank 4): 0,48 11,48 11,0 0,0
  pour Bottom: 96,8 96,40 91.5,40 91.5,27.5 93,27.5 93,14 91.5,14 91.5,8
ADC1  (via drill 0.38)
  Top 0.178: v14.48,9.65 40.51,9.65 v40.89,10.03 | U1.8 42.67,19.03 42.67,18.92 42.67,18.29 42.93,18.03 43.18,17.78 43.18,12.45 43.18,12.32 v42.42,11.56
  Bottom 0.178: R27.1 R26.1 13.66,10.85 14.48,10.03 v14.48,9.65 | v40.89,10.03 v42.42,11.56
ADC1-IN
  Bottom 0.178: R26.2 13,7 J4.1
ADC2  (via drill 0.38)
  Top 0.178: U1.9 43.18,18.83 43.18,18.41 43.5,18.1 43.56,18.03 v43.56,11.3 | v22.61,9.02 40.39,9.02 41.27,9.02 v41.66,9.4
  Bottom 0.178: R29.1 R28.1 21.66,10.85 21.84,10.67 22.61,9.91 v22.61,9.02 | v41.66,9.4 v43.56,11.3
ADC2-IN
  Bottom 0.178: R28.2 21,7 J9.1
BOOT0  (via drill 0.38)
  Top 0.178: U1.60 42.55,26.95 v43.5,26
  Bottom 0.178: v43.5,26 TP1.1
F4-VCAP-1  (via drill 0.38)
  Top 0.178: v48.01,29.21 48.61,29.21 U1.47
  Bottom 0.178: v48.01,29.21 47.07,30.15 C11.2
F4-VCAP-2  (via drill 0.38)
  Top 0.178: U1.31 53.6,23 52.44,23 v52.07,23.37
  Bottom 0.178: C12.2 52.46,23 52.44,23 v52.07,23.37
GND  (via drill 0.38)
  Top 0.178: Q6.1 60.49,23.53 61.09,24.13 61.43,24.47 Q3.4 | 3.03,11.12 LED11.C 2.08,11.12 v2.03,11.18 | U2.3 32.89,30.99 | 32.89,30.99 v32,30.99 | U2.2 32.89,30.99 | LED3.C 2.08,36.88 v2.03,36.83 | LED1.C 2.06,33.88 v2.03,33.91 | LED7.C 2.05,30.88 v2.03,30.86 | LED6.C 2.1,27.88 v2.03,27.94 | LED2.C 2.05,24.88 v2.03,24.89 | LED4.C 2.1,20.12 v2.03,20.19 | LED9.C 2.05,17.12 v2.03,17.14 | LED10.C 2.06,14.12 v2.03,14.1 | U3.11 34.6,21.4 v35.5,20.5 | U3.18 34.8,25 34.6,25.2 U3.20
  Bottom 0.178: Q7.4 92.65,13.97 91.82,13.97 v91.69,13.84 | C8.1 47,15.36 47.12,15.24 v47.24,15.24
  Bottom 0.508: U4.2 92.08,29 92.08,28.96 | C7.1 40.15,25.76
  Bottom 0.762: 92.08,27.05 92.08,28.96 92.08,32 90.04,32
  other vias: 34.5,19.5 36.5,19.5 36.5,21.5 37.5,20.5 24.5,15 24.5,14 27.5,14 27.5,13 28.5,13 28.5,12 29.5,12 46,34 47,34 46,33 47,33 38.5,21.5 26.5,25.5 26.5,26.5 27.5,26.5 26.5,23.5 26.5,21.5 27.5,21.5 26.5,24.5 26.5,22.5 27.5,30.5 26.5,30.5 26.5,31.5 40,27 38.5,25.5 37,27.5 87,25.02 88.01,25.27 89.03,25.02 90.04,25.02 87,22.48 88.01,22.23 85.98,25.02 85.98,22.48 90.04,26.04 89.03,26.04
  pour Top (rank 3): 8,42 87,42 92,37 92,11 87,6 8,6
  pour Bottom (rank 6): 0,48 96,48 96,0 0,0
  pour Top (rank 2): 91.5,30 96,30 96,15.5 94,15.5 91.5,13
I2C2-SCL  (via drill 0.38)
  Top 0.178: U1.29 53.08,22.1 52.7,22.1 51.94,21.34 51.18,21.34 50.8,21.72 v50.8,22.61 | v57.66,19.94 61.72,15.88 74.12,15.88 J16.1
  Bottom 0.178: v57.66,19.94 55.88,21.72 53.85,21.72 52.96,22.61 v50.8,22.61 50.8,21.72 50.93,21.59 51.94,20.57 51.94,16.51 51.58,16.15 R31.1
I2C2-SDA  (via drill 0.38)
  Top 0.178: U1.30 53.41,22.48 52.58,22.48 52.45,22.48 51.94,21.97 v51.56,21.97 | v57.66,18.92 61.21,15.37 69.6,15.37 72.63,15.37 J16.2
  Bottom 0.178: 51.69,21.84 v51.56,21.97 51.69,21.84 | 51.69,21.84 52.32,21.84 | 52.32,21.84 52.96,21.84 53.72,21.08 55.5,21.08 v57.66,18.92 | R33.1 49,15.52 49.28,15.24 51.56,15.24 51.82,15.49 52.32,16 52.32,20.95 52.32,21.84
KILL  (via drill 0.38)
  Top 0.178: v10.67,39.88 v16,39.88 v29.97,39.88 v42.04,39.88 v53.98,39.88 | v8,37.97 XBEE.20 8,32.26 v8.26,32 | R15.1 7.7,27 v8.26,27.56
  Bottom 0.178: Q5.2 Q5.5 v16,39.88 | Q2.2 Q2.5 42,39.84 v42.04,39.88 | Q1.2 Q1.5 54,39.85 v53.98,39.88 | v10.67,39.88 10.67,39.52 R3.1 8.88,38.85 v8,37.97 | 30,39.85 v29.97,39.88 30,39.85 | v8.26,32 10.26,30 TP2.1 10.59,29.59 9.78,29.59 8.26,28.07 v8.26,27.56 | 30,39.85 Q4.5 Q4.2
MIC-BP  (via drill 0.38)
  Top 0.178: C4.2 89.51,28.85 v89.79,28.57
  Bottom 0.178: v89.79,28.57 90.31,28.05 U4.4
MPU9250-REGOUT
  pour Top: 34,22.5 34.5,22.5 34.5,20.5 33.5,19.5 32,19.5 32,20.5
N$2
  Top 0.178: LED9.A 5.03,18.88 R17.2
N$3
  Top 0.178: LED10.A 4.03,15.88 R23.2
N$4
  Top 0.178: LED11.A 4.11,12.88 4.83,13.59 5.15,13.91 R24.2
N$34
  Top 0.178: LED6.A 4.03,26.12 R12.2
N$35
  Top 0.178: LED7.A 3.03,29.12 3.64,29.12 3.94,28.83 3.94,28.21 R15.2
N$36
  Top 0.178: LED2.A 5.03,23.12 R2.2
N$37
  Top 0.178: LED4.A 4.27,21.88 R10.2
N$38
  Top 0.178: R1.2 4.19,29.96 4.19,30.1 4.19,30.93 4.19,31.62 3.68,32.13 LED1.A
N$39
  Top 0.178: LED3.A 3.87,35.12 4.83,34.16 5.15,33.84 R9.2
OSC-IN
  Top 0.178: C1.2 37.16,18.86 Y1.2 38.92,17.97 39.49,17.97 U1.5
OSC-OUT
  Top 0.178: C2.2 40.86,15.15 Y1.1 39.81,17.08 39.81,17.58 U1.6
OTG-HS-D'_N
  Top 0.254: U1.35 55.18,27.29 55.39,27.29
  Top 0.61: 55.39,27.29 56.42,28.32 56.64,28.32 57.26,28.32 57.33,28.32 R37.1
OTG-HS-D'_P  (via drill 0.3)
  Top 0.254: U1.36 54.85,27.67 54.85,27.83
  Top 0.61: 56.5,29.08 56.64,29.08 57.3,29.08 57.65,29.43 R35.1 | 56.5,29.08 56.1,29.08 54.85,27.83 | v57,29.5 56.5,29.08
  Bottom 0.61: R34.1 56.35,29.5 v57,29.5
OTG-HS-D_N
  Top 0.178: 90.28,23.37 91.34,23.37 J22.2
  Top 0.61: 88,23.37 73.12,23.37 71.87,24.62 68.17,28.32 67.69,28.32 59.78,28.32 59.46,28 R37.2 | 88,23.37 90.28,23.37 | TP7.1 88,23.37
OTG-HS-D_P
  Top 0.178: 90.28,24.13 91.34,24.13 J22.3
  Top 0.61: 88,24.13 73.44,24.13 72.41,25.16 68.48,29.08 67.69,29.08 59.75,29.08 59.35,29.48 R35.2 | 88,24.13 90.28,24.13 | TP8.1 88,24.13
PA4
  Top 0.178: J3.1 57,10.29 57,11.07 51.56,16.51 51.56,17.26 U1.20
PA5
  Top 0.178: U1.21 51.94,17.58 51.94,16.76 53.09,15.62 62.71,6 J8.1
PA12  (via drill 0.38)
  Top 0.178: U1.45 51.56,30.74 51.56,31.37 51.56,31.88 51.31,32.13 51.05,32.13 50.55,32.64 50.29,32.64 v49.53,33.4 | v41.78,35.05 40.77,35.05 40.39,34.54 31.88,34.54 27.57,34.54 25.53,32.5 25.27,32.25 25.27,31.37 25.27,30.73 16.26,21.72 v15.23,20.69 | R17.1 7.82,19 v8.13,19.3
  Bottom 0.178: v49.53,33.4 47.88,35.05 v41.78,35.05 | v8.13,19.3 9.52,20.69 v15.23,20.69
PA15  (via drill 0.38)
  Top 0.178: U1.50 44.58,32.02 44.58,32.89 44.58,33.15 v44.96,33.53 | v41.78,34.04 40.77,34.04 27.69,34.04 25.78,32.12 25.78,30.23 25.78,29.46 v16.12,19.8 | R23.1 7.89,17 v8.13,16.76
  Bottom 0.178: v44.96,33.53 44.45,34.04 v41.78,34.04 | v8.13,16.76 8.89,16 14.73,16 16.12,17.39 v16.12,19.8
PB2  (via drill 0.38)
  Top 0.178: U1.28 54.16,20.32 54.74,20.32 54.86,20.32 v54.99,20.45 | v46.48,11.68 45.85,12.32 44.7,12.32 v44.32,12.7 | R24.1 v8.38,13.47 v8.38,13.46 | v19.18,13.84 21.08,15.75 23.62,15.75 27.18,15.75 31.11,11.81 41.27,11.81 v41.53,12.06
  Bottom 0.178: v54.99,20.45 55.75,19.68 55.75,17.4 52.83,14.48 49.53,14.48 47.75,12.7 46.74,11.68 v46.48,11.68 | v44.32,12.7 43.94,12.32 41.78,12.32 v41.53,12.06 | v8.38,13.46 18.8,13.46 v19.18,13.84
PC4
  Top 0.178: U1.24 63.14,8.51 65.53,8.51 66.49,8.51 J12.1
PC5
  Top 0.178: U1.25 63.34,9.02 68.96,9.02 71.98,9.02 J14.1
RST  (via drill 0.3, 0.38)  (1 unrouted)
  Top 0.178: U1.7 44.15,21.21 v44.45,21.21 | J21.1 89.85,37.85 S1.2 S1.1 79.9,37.19 v80.14,36.96 | 75.95,36.2 v76.07,36.32 73.03,33.27 66.17,33.27 57.28,33.27 v56.26,32.26
  Bottom 0.178: v44.45,21.21 45.21,21.21 52.7,28.7 52.7,29.72 53.47,30.48 54.48,30.48 56.2,32.2 v56.26,32.26 | R25.1 87,35 J21.1 | v76.07,36.32 79.76,36.32 80.14,36.7 v80.14,36.96
SDIO-CK  (via drill 0.3)
  Top 0.178: U1.53 43.05,31.42 43.05,35.43 45.21,37.59 45.72,38.1 45.85,38.23 v66.8,38.23 | v68.45,45.09 67.42,45.09 TP13.1
  Bottom 0.178: v66.8,38.23 66.9,38.33 J23.5 66.9,44.68 67.31,45.09 68.33,45.09 v68.45,45.09
SDIO-CMD  (via drill 0.3)
  Top 0.178: U1.54 42.55,31.22 42.55,35.69 44.96,38.1 45.72,38.86 v69.09,38.86 | v69.34,45.09 69.34,42.66 TP14.1
  Bottom 0.178: v69.09,38.86 69.09,43.84 J23.3 69.1,44.84 v69.34,45.09
SDIO-D0  (via drill 0.3)
  Top 0.178: U1.39 54.74,29.68 54.74,30.23 54.74,31.75 54.74,32.51 55.75,33.53 56.77,34.54 v64.64,34.54 | v64.39,45.09 64.39,42.61 TP9.1
  Bottom 0.178: v64.64,34.54 64.7,34.6 J23.7 64.7,44.77 v64.39,45.09
SDIO-D1  (via drill 0.3)
  Top 0.178: U1.40 54.23,29.88 54.23,32 54.23,32.77 55.5,34.04 56.64,35.18 v63.5,35.18 | v63.5,45.09 62.41,45.09 TP10.1
  Bottom 0.178: v63.5,35.18 63.6,35.28 J23.8 63.6,44.98 v63.5,45.09
SDIO-D2  (via drill 0.3)
  Top 0.178: U1.51 44.07,31.82 44.07,34.92 45.72,36.58 46.1,36.96 v71.25,36.96 | v72.01,42.93 74.07,42.93 TP11.1
  Bottom 0.178: v71.25,36.96 71.3,37.01 J23.1 71.3,43.63 v72.01,42.93
SDIO-D3  (via drill 0.3)
  Top 0.178: U1.52 43.56,31.62 43.56,35.05 43.56,35.18 45.47,37.08 45.72,37.34 45.97,37.59 v70.1,37.59 | v70.23,45.09 71.58,45.09 TP12.1
  Bottom 0.178: v70.1,37.59 70.2,37.69 J23.2 70.2,45.05 v70.23,45.09
SPI1-MISO  (via drill 0.38)
  Top 0.178: v45.72,27.94 45.72,27.81 45.34,27.43 44.92,27.43 U1.56 40.1,32.26 34.29,32.26 34.04,32 34.04,31.11 34.78,30.38 | U2.6 34.78,30.38 | 34.78,30.38 34.69,30.38 34.29,29.97 v34.04,29.72 | TP5.1 31.08,29.08 v31.11,29.08 | U3.9 33.75,21.43 33.4,21.08 33.35,21.04 v32,21.04
  Bottom 0.178: R30.1 45,28.66 v45.72,27.94 | v34.04,29.72 34.04,29.46 32.77,28.19 32.45,27.88 | 32.45,27.88 32.26,27.69 32.26,27.05 32.26,21.97 32.26,21.59 32.26,21.29 v32,21.04 | v31.11,29.08 32.32,27.88 32.45,27.88
SPI1-MOSI  (via drill 0.38)
  Top 0.178: U1.57 40.02,31.62 36.2,31.62 | 36.2,31.62 U2.7 | v36.2,30.99 36.2,31.62 | 33.02,25.81 33,25.81 U3.24 v33,27.41 30.91,27.41 TP6.1
  Bottom 0.178: v36.2,30.99 36.2,28.96 35.56,28.32 33.91,28.32 v33,27.41
SPI1-SCK  (via drill 0.38)
  Top 0.178: U1.55 40.19,32.88 U2.8 36.05,32.88 36.07,32.89 v36.07,33.4 | TP4.1 31.47,30 31.88,29.59 31.88,28.96 31.88,28.57 32.26,28.19 33.27,28.19 v34.04,27.43 33.4,26.8 U3.23
  Bottom 0.178: v36.07,33.4 36.07,32.26 36.83,31.5 36.83,28.96 35.81,27.94 34.54,27.94 v34.04,27.43
SPI2-MISO  (via drill 0.38)
  Top 0.178: J18.2 33,8 41.15,8 43.43,8 45.34,9.91 v45.34,10.67 | U1.10 45.21,20.15 v45.21,20.45
  Bottom 0.178: v45.21,20.45 45,20.23 44.5,19.73 R32.1 45.47,16.88 45.47,15.49 44.96,14.99 44.96,12.32 44.7,12.06 44.7,11.3 v45.34,10.67
SPI2-MOSI  (via drill 0.38)
  Top 0.178: J18.3 31.51,8.51 31.88,8.51 41.27,8.51 43.05,8.51 44.58,10.03 44.58,10.92 v45.34,11.68 | U1.11 45.45,19.68 v45.97,19.68
  Bottom 0.178: v45.97,19.68 45.97,15.37 45.34,14.73 v45.34,11.68
SPI2-SCK  (via drill 0.38)
  Top 0.178: J18.1 34.49,7.49 41.27,7.49 43.69,7.49 46.48,10.29 v46.48,10.67 | U1.34 55.27,26.67 55.63,26.67 57.66,24.64 v57.66,23.24
  Bottom 0.178: v57.66,23.24 58.17,22.73 58.55,22.35 58.55,18.8 53.85,14.1 49.78,14.1 v46.48,10.67
SPISS-MPU9250
  Top 0.178: U1.3 40.94,20.83 40.13,20.83 37.08,23.88 37.08,25.4 36.7,25.78 35.69,26.8 35.31,26.8 34.2,26.8 33.8,26.4 U3.22
SPISS-MS5611
  Top 0.178: U1.2 40.74,21.34 40.26,21.34 38.23,23.37 37.59,24 37.59,25.65 35.1,28.15 U2.5 34.84,29.12 34.54,28.83 33.53,28.83 33.23,29.12 U2.4
STSB1+
  Top 0.178: LED5.A1 66.1,20.75 R13.2
STSB2+
  Bottom 0.178: LED8.A1 63.9,20.75 R18.2
STSB-  (via drill 0.3)
  Top 0.178: LED5.C1 66.1,24.57 v65.66,24.13 | Q3.6 62.48,25.53 63.25,24.77 63.88,24.13 v64.26,24.13
  Bottom 0.178: v65.66,24.13 64.39,24.13 v64.26,24.13 63.9,24.49 63.9,24.62 LED8.C1
STSG1+
  Top 0.178: LED5.A3 63.9,20.75 R11.2
STSG2+
  Bottom 0.178: LED8.A3 66.1,20.75 R16.2
STSG-  (via drill 0.38)
  Top 0.178: LED5.C3 63.9,27.07 v64.26,27.43 | Q3.3 59.4,24.47 v59.18,24.26
  Bottom 0.178: LED8.C3 66.1,26.99 66.04,27.05 65.66,27.43 v64.26,27.43 63.37,27.43 63.25,27.3 60.2,24.26 v59.18,24.26
STSR1+
  Top 0.178: LED5.A2 R8.2
STSR2+
  Bottom 0.178: LED8.A2 R14.2
STSR-  (via drill 0.38)
  Top 0.178: LED5.C2 v65,25.02 | v65,25.02 65,24.13 | Q6.6 64.55,23.53 64.64,23.62 65,23.98 65,24.13 | 65,24.13 v65,25.02
  Bottom 0.178: LED5.C2 v65,25.02
SWCLK  (via drill 0.3)
  Top 0.178: U1.49 48.26,32.67 48.26,34.04 48.77,34.54 50.55,36.32 70.61,36.32 70.87,36.07 72.01,36.07 72.77,36.83 74.55,38.61 75.95,38.61 76.33,38.23 76.33,37.72 76.33,37.47 v76.2,37.34 | v77.98,37.21 79.38,35.81 87,35.81 88.81,34 J21.3
  Bottom 0.178: v76.2,37.34 77.85,37.34 v77.98,37.21
SWDIO  (via drill 0.3)
  Top 0.178: U1.46 51.05,30.94 51.05,31.5 50.42,32.13 50.04,32.13 49.53,32.64 49.15,32.64 48.77,33.02 48.77,33.91 49.02,34.16 50.67,35.81 70.36,35.81 70.61,35.56 72.39,35.56 72.77,35.94 74.8,37.97 v75.56,37.97 | v77.98,38.35 78.61,37.72 78.61,37.21 79.63,36.2 82.3,36.2 89.81,36.2 J21.2
  Bottom 0.178: v75.56,37.97 77.6,37.97 v77.98,38.35
TIM1-CH1  (via drill 0.38)
  Top 0.178: U1.41 53.21,29.57 53.59,29.95 v53.59,33.4
  Bottom 0.178: 56.96,37.15 R4.2 53.59,33.74 v53.59,33.4
TIM1-CH1-K
  Bottom 0.178: Q1.6 56.88,38.73 R4.1 57,41 J1.1
TIM1-CH2  (via drill 0.38)
  Top 0.178: U1.42 52.7,29.77 53.09,30.15 53.09,32.89 52.7,33.27 v52.58,33.4
  Bottom 0.178: v52.58,33.4 51,34.98 R5.2
TIM1-CH2-K
  Bottom 0.178: J6.1 51,41 R5.1 51.01,38.86 51.56,38.86 53.15,37.27 Q1.3
TIM1-CH3  (via drill 0.38)
  Top 0.178: U1.43 52.2,29.96 52.58,30.35 52.58,32.38 52.2,32.77 v51.56,33.4
  Bottom 0.178: v51.56,33.4 47.81,37.15 R6.2
TIM1-CH3-K
  Bottom 0.178: J10.1 45,41 R6.1 44.88,38.73 Q2.6
TIM1-CH4  (via drill 0.38)
  Top 0.178: U1.44 51.69,30.16 52.07,30.55 52.07,31.88 52.07,32.13 51.56,32.64 51.44,32.64 51.31,32.64 v50.55,33.4
  Bottom 0.178: v50.55,33.4 47.88,36.07 45.21,36.07 40.08,36.07 R7.2
TIM1-CH4-K
  Bottom 0.178: J13.1 39,41 R7.1 39.64,38.85 40.26,38.23 41.22,37.27 Q2.3
TIM3-CH1-RSSI  (via drill 0.38)
  Top 0.178: R12.1 8.78,25 14.86,18.92 | 14.86,18.92 15.62,18.16 18,15.78 XBEE.6 19.07,14.5 19.3,14.73 20.83,16.26 21.46,16.26 27.56,16.26 27.69,16.13 31.37,12.32 36.07,12.32 40.77,12.32 40.89,12.45 41.15,12.7 42.04,12.7 v42.42,13.08 | U1.22 52.96,17.27 v52.96,16.89 | v46.48,12.7 45.47,12.7 v44.32,13.84 | v13.46,18.03 13.97,18.03 14.86,18.92
  Bottom 0.178: v52.96,16.89 52.96,15.88 51.94,14.86 49.28,14.86 48.13,13.72 47.12,12.7 v46.48,12.7 | v44.32,13.84 43.56,13.08 v42.42,13.08 | TP3.1 13.43,18 v13.46,18.03
TIM3-CH2-STSR  (via drill 0.38)
  Top 0.178: v55.12,19.05 56.01,19.94 59.05,22.99 60.26,22.99 Q6.2 | U1.23 53.98,16.96 v53.98,16.64
  Bottom 0.178: v53.98,16.64 55.12,17.78 v55.12,19.05
TIM3-CH3-STSG  (via drill 0.38)
  Top 0.178: Q3.5 62.38,25 62.48,24.89 62.61,24.77 62.74,24.64 v62.74,24.26 | U1.26 52.74,20.29 54.74,18.29 55.5,18.29 56.01,18.8 56.01,19.3 56.01,19.43 56.64,20.07 58.29,21.72 62.1,21.72 62.74,22.35 v62.74,22.86
  Bottom 0.178: v62.74,24.26 v62.74,22.86
TIM3-CH4-STSB
  Top 0.178: U1.27 53.96,19.81 55.37,19.81 58.42,22.86 58.42,24 58.42,24.51 58.91,25 59.42,25 Q3.2
TIM4-CH1  (via drill 0.38)
  Top 0.178: v39.75,30.73 40.2,30.73 U1.58
  Bottom 0.178: R19.2 33,36.09 33.4,35.69 37.72,35.69 39.75,33.66 39.75,32.89 39.75,32.38 v39.75,30.73
TIM4-CH1-K
  Bottom 0.178: J2.1 33,41 R19.1 32.88,38.73 Q4.6
TIM4-CH2  (via drill 0.38)
  Top 0.178: 40.51,29.72 v40.13,29.72 40.51,29.72 | U1.59 40.51,29.72
  Bottom 0.178: R20.2 27,35.74 27.56,35.18 36.58,35.18 36.96,35.18 37.47,35.18 38.99,33.66 38.99,33.15 38.99,32.64 38.99,30.35 39.62,29.72 v40.13,29.72
TIM4-CH2-K
  Bottom 0.178: J7.1 27,41 R20.1 27.57,38.85 27.94,38.48 29.15,37.27 Q4.3
TIM4-CH3  (via drill 0.38)
  Top 0.178: v38.23,30.1 38.72,30.1 U1.61
  Bottom 0.178: R21.2 19,36.12 20.45,34.67 36.58,34.67 36.96,34.67 37.21,34.67 38.23,33.66 38.23,33.4 38.23,32.89 v38.23,30.1
TIM4-CH3-K
  Bottom 0.178: J11.1 19,41 R21.1 18.88,38.73 Q5.6
TIM4-CH4  (via drill 0.38)
  Top 0.178: v37.47,28.7 39.41,28.7 U1.62
  Bottom 0.178: R22.2 15.99,34.16 36.45,34.16 36.96,34.16 37.08,34.04 37.47,33.66 v37.47,28.7
TIM4-CH4-K
  Bottom 0.178: J15.1 13,39 R22.1 13.01,38.86 13.59,38.86 15.18,37.27 Q5.3
UART2-RX-XBEE  (via drill 0.38)
  Top 0.178: U1.17 51.31,15.39 53.09,13.61 v53.09,4.06 | R10.1 7.83,21 8,20.83 10,18.83 XBEE.2 10,11.46 11.43,10.03 12.57,10.03 13.97,11.43 15.24,12.7 25.78,12.7 27.69,10.79 39.5,10.79 41.4,10.79 v42.8,9.4
  Bottom 0.178: v42.8,9.4 44.6,9.4 J17.2 49.94,4.06 v53.09,4.06
UART2-TX-XBEE  (via drill 0.38)
  Top 0.178: U1.16 50,13.59 J17.1 | R2.1 8.37,23 8.51,22.86 12,19.37 XBEE.3 13.53,11.5 15.11,13.08 19.3,13.08 26.16,13.08 27.94,11.3 33.53,11.3 38.61,11.3 41.53,11.3 41.78,11.05 42.67,10.16 v43.56,10.16
  Bottom 0.178: J17.1 48.63,7.37 48.39,7.37 47.24,7.37 44.83,9.78 43.94,9.78 v43.56,10.16
UART4-RX
  Top 0.178: J20.2 41.3,4.7 41.53,4.7 42.42,4.7 43.18,4.7 48.51,10.03 48.51,12.95 47.75,13.72 45.34,16.13 45.34,16.74 U1.15
UART4-TX
  Top 0.178: U1.14 44.96,17.07 44.96,15.88 47.24,13.59 48.01,12.83 48.01,10.29 43.72,6 42.67,6 | 42.96,6 42.67,6 | 42.67,6 J20.1
UART6-RX-GPS  (via drill 0.38)
  Top 0.178: v77.22,40.26 76.83,39.88 76.83,35.81 76.83,35.69 73.91,32.77 57.66,32.77 56.13,31.24 55.24,30.35 55.24,29.59 53.85,28.19 53.85,28.08 U1.38
  Bottom 0.178: v77.22,40.26 80.26,40.26 J19.3
UART6-TX-GPS
  Top 0.178: J19.2 77.34,39.34 77.34,39.24 77.34,35.56 77.34,35.43 74.17,32.26 57.78,32.26 56.52,30.99 55.63,30.1 55.63,29.46 54.23,28.07 54.23,27.75 U1.37
  Bottom 0.178: J19.2
USD-CD  (via drill 0.3, 0.38)
  Top 0.178: U1.33 54.07,24.77 53.47,24.77 52.83,25.4 v52.7,25.53 v50.17,28.06 | v55.37,32.26 55.37,32.38 56.9,33.91 64.9,33.91 65.41,34.42 v65.41,35.18 | v65.41,39.62 v62.87,39.62
  Bottom 0.178: v50.17,28.06 50.67,27.56 51.05,27.56 52.32,28.83 52.32,29.84 53.34,30.86 53.98,30.86 54.36,30.86 55.37,31.88 v55.37,32.26 | R36.1 55.85,26.26 55.63,26.04 53.21,26.04 53.09,25.91 v52.7,25.53 | v65.41,35.18 v65.41,39.62 | v62.87,39.62 62.1,39.62 61.91,39.81 | 61.91,39.81 61.72,40.01 | 61.91,39.81 61.66,40.07 J23.CD
VIN  (via drill 0.38)
  other vias: 88.5,13 87.5,14 89.5,14 87.5,15.5 87.5,17 87.5,18.5 89,20 87.5,20 90.5,20
  pour Top: 90,23 89,22 88.5,22 87,20.5 87,13.5 88.5,12 91,12 91,23
  pour Bottom (rank 2): 91,12 88.5,12 87,13.5 87,20.5 92.5,20.5 92.5,13.5

### Text on the board
tDocu: DESIGNED FOR .031" BOARD THICKNESS
tSilk: D0 | CMD | D2 | D1 | CK | D3 | T4-4 | T4-3 | T4-2 | T4-1 | T1-4 | T1-3 | T1-2 | T1-1 | UART6 | 5V | FLY THIS WAY | SWD | 3V3 | KILL | Y | SCK | MISO | MOSI | RSSI | G | X | TX | X | RX | M | Y | A12 | A15 | B2 | OSURC AERIAL | Flight Controller v3.9.1 | S. Yoo | 5Vin | ADC1 | ADC2 | SPI2 | UART4 | UART2 | A4 | A5 | C4 | C5 | I2C2
bSilk: THIS SIDE DOWN